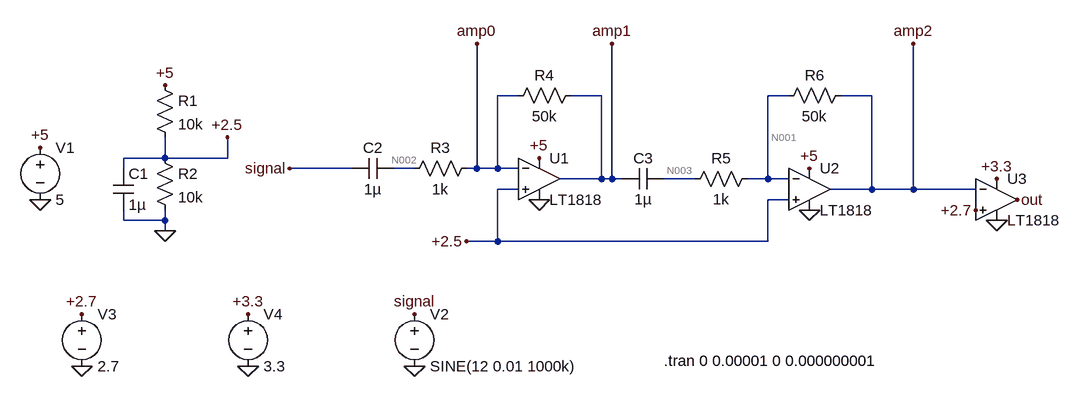
[diagram p0: schematic ac2.asc]
ac2.asc, the LTspice schematic file:
Version 4
SHEET 1 1640 680
WIRE 800 48 768 48
WIRE 928 48 880 48
WIRE 1216 48 1184 48
WIRE 1344 48 1296 48
WIRE 256 144 256 112
WIRE 256 144 192 144
WIRE 352 144 352 112
WIRE 352 144 256 144
WIRE 192 160 192 144
WIRE 544 160 448 160
WIRE 640 160 608 160
WIRE 736 160 736 -32
WIRE 736 160 720 160
WIRE 768 160 768 48
WIRE 768 160 736 160
WIRE 800 160 768 160
WIRE 928 176 928 48
WIRE 928 176 864 176
WIRE 944 176 944 -32
WIRE 944 176 928 176
WIRE 960 176 944 176
WIRE 1072 176 1024 176
WIRE 1184 176 1184 48
WIRE 1184 176 1152 176
WIRE 1216 176 1184 176
WIRE 800 192 768 192
WIRE 1344 192 1344 48
WIRE 1344 192 1280 192
WIRE 1408 192 1408 -32
WIRE 1408 192 1344 192
WIRE 1504 192 1408 192
WIRE 1216 208 1184 208
WIRE 192 240 192 224
WIRE 256 240 256 224
WIRE 256 240 192 240
WIRE 256 256 256 240
WIRE 768 272 768 192
WIRE 768 272 720 272
WIRE 1184 272 1184 208
WIRE 1184 272 768 272
FLAG 64 208 0
FLAG 64 128 +5
FLAG 256 32 +5
FLAG 256 256 0
FLAG 352 112 +2.5
FLAG 640 384 signal
FLAG 640 464 0
FLAG 720 272 +2.5
FLAG 832 144 +5
FLAG 832 208 0
FLAG 1248 224 0
FLAG 1248 160 +5
FLAG 128 384 +2.7
FLAG 384 384 +3.3
FLAG 1536 176 +3.3
FLAG 128 464 0
FLAG 384 464 0
FLAG 1536 240 0
FLAG 1504 224 +2.7
FLAG 1568 208 out
FLAG 448 160 signal
FLAG 1408 -32 amp2
FLAG 944 -32 amp1
FLAG 736 -32 amp0
SYMBOL voltage 64 112 R0
WINDOW 123 0 0 Left 2
WINDOW 39 0 0 Left 2
SYMATTR InstName V1
SYMATTR Value 5
SYMBOL res 240 16 R0
SYMATTR InstName R1
SYMATTR Value 10k
SYMATTR SpiceLine tol=1
SYMBOL res 240 128 R0
SYMATTR InstName R2
SYMATTR Value 10k
SYMATTR SpiceLine tol=1
SYMBOL cap 176 160 R0
SYMATTR InstName C1
SYMATTR Value 1µ
SYMBOL Opamps\\LT1818 832 176 R0
SYMATTR InstName U1
SYMBOL Opamps\\LT1818 1248 192 R0
SYMATTR InstName U2
SYMBOL voltage 640 368 R0
WINDOW 123 0 0 Left 2
WINDOW 39 0 0 Left 2
SYMATTR InstName V2
SYMATTR Value SINE(12 0.01 1000k)
SYMBOL cap 608 144 R90
WINDOW 0 0 32 VBottom 2
WINDOW 3 32 32 VTop 2
SYMATTR InstName C2
SYMATTR Value 1µ
SYMBOL res 736 144 R90
WINDOW 0 0 56 VBottom 2
WINDOW 3 32 56 VTop 2
SYMATTR InstName R3
SYMATTR Value 1k
SYMBOL res 896 32 R90
WINDOW 0 0 56 VBottom 2
WINDOW 3 32 56 VTop 2
SYMATTR InstName R4
SYMATTR Value 50k
SYMBOL res 1168 160 R90
WINDOW 0 0 56 VBottom 2
WINDOW 3 32 56 VTop 2
SYMATTR InstName R5
SYMATTR Value 1k
SYMATTR SpiceLine tol=1
SYMBOL res 1312 32 R90
WINDOW 0 0 56 VBottom 2
WINDOW 3 32 56 VTop 2
SYMATTR InstName R6
SYMATTR Value 50k
SYMATTR SpiceLine tol=1
SYMBOL Opamps\\LT1818 1536 208 R0
SYMATTR InstName U3
SYMBOL voltage 128 368 R0
WINDOW 123 0 0 Left 2
WINDOW 39 0 0 Left 2
SYMATTR InstName V3
SYMATTR Value 2.7
SYMBOL voltage 384 368 R0
WINDOW 123 0 0 Left 2
WINDOW 39 0 0 Left 2
SYMATTR InstName V4
SYMATTR Value 3.3
SYMBOL cap 1024 160 R90
WINDOW 0 0 32 VBottom 2
WINDOW 3 32 32 VTop 2
SYMATTR InstName C3
SYMATTR Value 1µ
TEXT 1024 456 Left 2 !.tran 0 0.00001 0 0.000000001

The netlist it stands for:
* ac2.asc
V1 +5 0 5
R1 +5 +2.5 10k tol=1
R2 +2.5 0 10k tol=1
C1 +2.5 0 1µ
XU1 +2.5 amp0 amp1 +5 0 LT1818  ; pins In+ In- OUT V+ V-
XU2 +2.5 N001 amp2 +5 0 LT1818  ; pins In+ In- OUT V+ V-
V2 signal 0 SINE(12 0.01 1000k)
C2 N002 signal 1µ
R3 amp0 N002 1k
R4 amp1 amp0 50k
R5 N001 N003 1k tol=1
R6 amp2 N001 50k tol=1
XU3 +2.7 amp2 out +3.3 0 LT1818  ; pins In+ In- OUT V+ V-
V3 +2.7 0 2.7
V4 +3.3 0 3.3
C3 N003 amp1 1µ
.tran 0 0.00001 0 0.000000001
.lib LTC2.lib
.backanno
.end

* Results of the author's LTspice run, read from the files saved beside the schematic
* Operating Point, zero values left out:
*   V(+5) = 5 V
*   V(+2.5) = 2.517 V
*   V(amp0) = 2.518 V
*   V(amp1) = 2.43 V
*   V(n001) = 2.518 V
*   V(amp2) = 2.43 V
*   V(signal) = 12 V
*   V(n002) = 2.518 V
*   V(n003) = 2.518 V
*   V(+2.7) = 2.7 V
*   V(+3.3) = 3.3 V
*   V(out) = 2.425 V
*   I(R6) = -1.748 µA
*   I(R4) = -1.748 µA
*   I(R2) = 251.7 µA
*   I(R1) = 248.3 µA
*   I(V4) = -8.319 mA
*   I(V3) = -300.1 nA
*   I(V1) = -17.25 mA
*   Ix(u1:1) = -1.748 µA
*   Ix(u1:2) = -1.748 µA
*   Ix(u1:3) = 1.748 µA
*   Ix(u1:4) = 8.499 mA
*   Ix(u1:5) = -8.498 mA
*   Ix(u2:1) = -1.748 µA
*   Ix(u2:2) = -1.748 µA
*   Ix(u2:3) = 3.615 µA
*   Ix(u2:4) = 8.498 mA
*   Ix(u2:5) = -8.499 mA
*   Ix(u3:1) = 300.1 nA
*   Ix(u3:2) = -1.867 µA
*   Ix(u3:3) = -1.55 pA
*   Ix(u3:4) = 8.319 mA
*   Ix(u3:5) = -8.317 mA
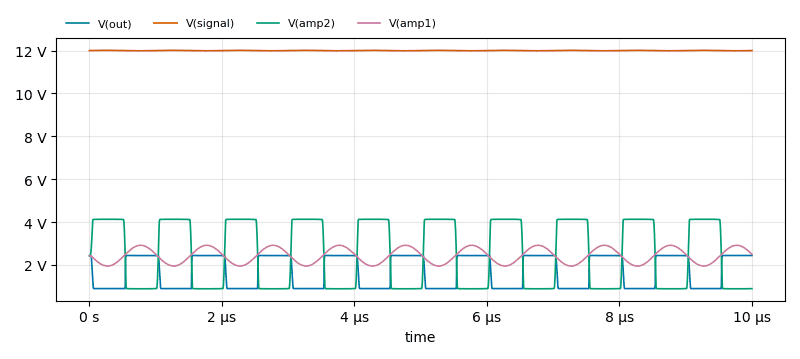
[diagram p1: Transient Analysis of ac2.asc, plotted from the saved traces]
* Transient Analysis, 1 run:
*   V(out): min 893.3 mV, max 2.437 V, average 1.687 V, rms 1.851 V, last 2.437 V
*   V(signal): min 11.99 V, max 12.01 V, average 12 V, rms 12 V, last 12 V
*   V(amp2): min 884 mV, max 4.129 V, average 2.51 V, rms 2.967 V, last 892.6 mV
*   V(amp1): min 1.944 V, max 2.916 V, average 2.43 V, rms 2.454 V, last 2.497 V